# EAGLE design LinearVCA (EAGLE 9.2.0)
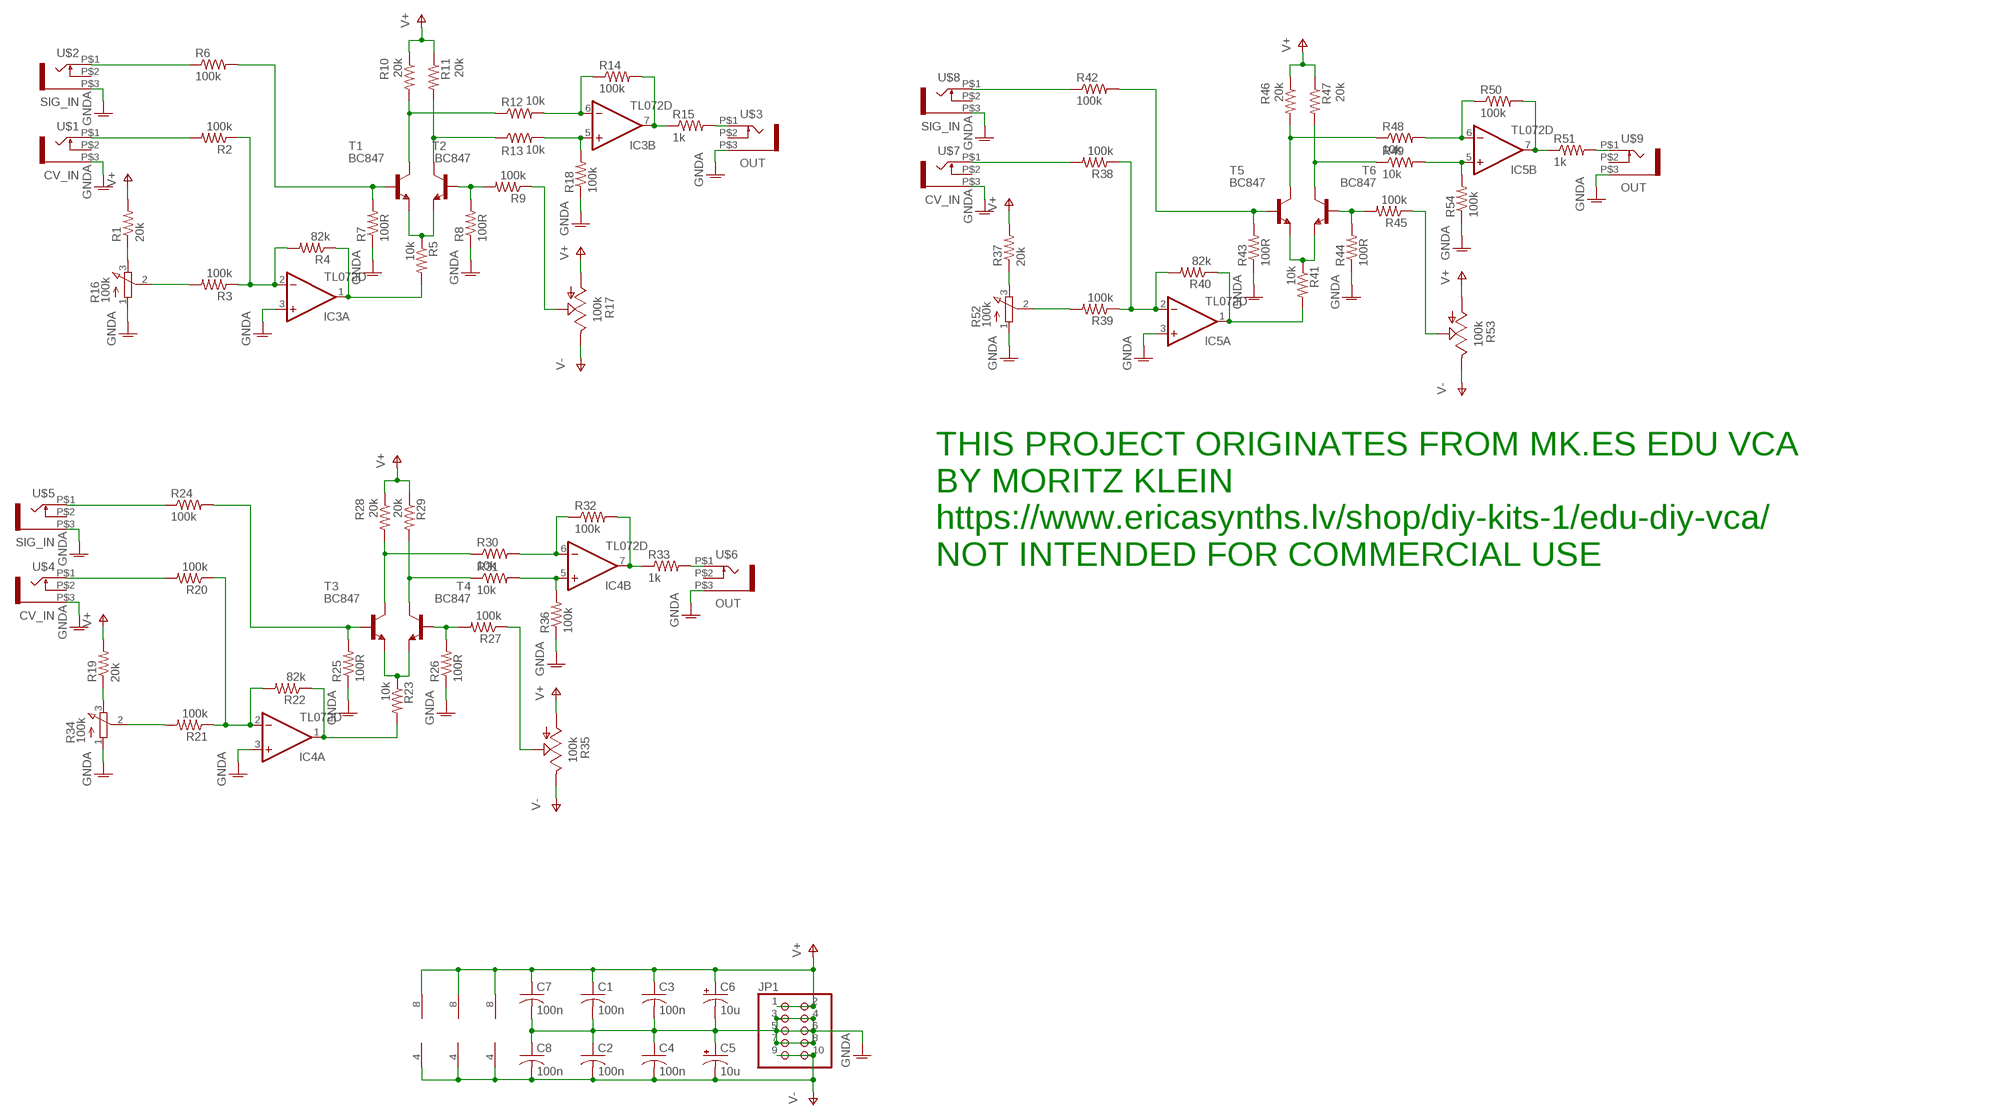
[diagram p0: schematic, sheet 1]

## Parts
C1  100n  C-USC0603K  [C0603K]
C2  100n  C-USC0603K  [C0603K]
C3  100n  C-USC0603K  [C0603K]
C4  100n  C-USC0603K  [C0603K]
C5  10u  CPOL-USE2-5  [E2-5]
C6  10u  CPOL-USE2-5  [E2-5]
C7  100n  C-USC0603K  [C0603K]
C8  100n  C-USC0603K  [C0603K]
IC3  TL072D  [SO08]
IC4  TL072D  [SO08]
IC5  TL072D  [SO08]
JP1  PINHD-2X5  [2X05]
R1  20k  R-US_R0603  [R0603]
R2  100k  R-US_R0603  [R0603]
R3  100k  R-US_R0603  [R0603]
R4  82k  R-US_R0603  [R0603]
R5  10k  R-US_R0603  [R0603]
R6  100k  R-US_R0603  [R0603]
R7  100R  R-US_R0603  [R0603]
R8  100R  R-US_R0603  [R0603]
R9  100k  R-US_R0603  [R0603]
R10  20k  R-US_R0603  [R0603]
R11  20k  R-US_R0603  [R0603]
R12  10k  R-US_R0603  [R0603]
R13  10k  R-US_R0603  [R0603]
R14  100k  R-US_R0603  [R0603]
R15  1k  R-US_R0603  [R0603]
R16  100k  EVUF3K  [EVUFXK]
R17  100k  TRIM_US-RJ9W  [RJ9W]
R18  100k  R-US_R0603  [R0603]
R19  20k  R-US_R0603  [R0603]
R20  100k  R-US_R0603  [R0603]
R21  100k  R-US_R0603  [R0603]
R22  82k  R-US_R0603  [R0603]
R23  10k  R-US_R0603  [R0603]
R24  100k  R-US_R0603  [R0603]
R25  100R  R-US_R0603  [R0603]
R26  100R  R-US_R0603  [R0603]
R27  100k  R-US_R0603  [R0603]
R28  20k  R-US_R0603  [R0603]
R29  20k  R-US_R0603  [R0603]
R30  10k  R-US_R0603  [R0603]
R31  10k  R-US_R0603  [R0603]
R32  100k  R-US_R0603  [R0603]
R33  1k  R-US_R0603  [R0603]
R34  100k  EVUF3K  [EVUFXK]
R35  100k  TRIM_US-RJ9W  [RJ9W]
R36  100k  R-US_R0603  [R0603]
R37  20k  R-US_R0603  [R0603]
R38  100k  R-US_R0603  [R0603]
R39  100k  R-US_R0603  [R0603]
R40  82k  R-US_R0603  [R0603]
R41  10k  R-US_R0603  [R0603]
R42  100k  R-US_R0603  [R0603]
R43  100R  R-US_R0603  [R0603]
R44  100R  R-US_R0603  [R0603]
R45  100k  R-US_R0603  [R0603]
R46  20k  R-US_R0603  [R0603]
R47  20k  R-US_R0603  [R0603]
R48  10k  R-US_R0603  [R0603]
R49  10k  R-US_R0603  [R0603]
R50  100k  R-US_R0603  [R0603]
R51  1k  R-US_R0603  [R0603]
R52  100k  EVUF3K  [EVUFXK]
R53  100k  TRIM_US-RJ9W  [RJ9W]
R54  100k  R-US_R0603  [R0603]
T1  BC847  [SOT23]
T2  BC847  [SOT23]
T3  BC847  [SOT23]
T4  BC847  [SOT23]
T5  BC847  [SOT23]
T6  BC847  [SOT23]
U$1  CV_IN  WQP-PJ301M-12_JACK  [WQP-PJ301M-12_JACK]
U$2  SIG_IN  WQP-PJ301M-12_JACK  [WQP-PJ301M-12_JACK]
U$3  OUT  WQP-PJ301M-12_JACK  [WQP-PJ301M-12_JACK]
U$4  CV_IN  WQP-PJ301M-12_JACK  [WQP-PJ301M-12_JACK]
U$5  SIG_IN  WQP-PJ301M-12_JACK  [WQP-PJ301M-12_JACK]
U$6  OUT  WQP-PJ301M-12_JACK  [WQP-PJ301M-12_JACK]
U$7  CV_IN  WQP-PJ301M-12_JACK  [WQP-PJ301M-12_JACK]
U$8  SIG_IN  WQP-PJ301M-12_JACK  [WQP-PJ301M-12_JACK]
U$9  OUT  WQP-PJ301M-12_JACK  [WQP-PJ301M-12_JACK]

## Nets
GNDA: C1.2 C2.1 C3.2 C4.1 C5.+ C6.- C7.2 C8.1 IC3.3(A:+IN) IC4.3(A:+IN) IC5.3(A:+IN) JP1.3 JP1.4 JP1.5 JP1.6 JP1.7 JP1.8 R7.1 R8.1 R16.1(A) R18.1 R25.1 R26.1 R34.1(A) R36.1 R43.1 R44.1 R52.1(A) R54.1 U$1.P$3 U$2.P$3 U$3.P$3 U$4.P$3 U$5.P$3 U$6.P$3 U$7.P$3 U$8.P$3 U$9.P$3
N$1: IC3.2(A:-IN) R2.1 R3.1 R4.2
N$2: R1.1 R16.3(E)
N$3: R3.2 R16.2(S)
N$4: R2.2 U$1.P$1
N$5: IC3.1(A:OUT) R4.1 R5.2
N$6: R5.1 T1.2(E) T2.2(E)
N$8: R6.2 R7.2 T1.1(B)
N$9: R6.1 U$2.P$1
N$10: R8.2 R9.2 T2.1(B)
N$11: R9.1 R17.S
N$12: R10.2 R12.1 T1.3(C)
N$13: R11.2 R13.1 T2.3(C)
N$14: IC3.6(B:-IN) R12.2 R14.1
N$15: IC3.5(B:+IN) R13.2 R18.2
N$16: R15.2 U$3.P$1
N$17: IC3.7(B:OUT) R14.2 R15.1
N$18: IC4.2(A:-IN) R20.1 R21.1 R22.2
N$19: R19.1 R34.3(E)
N$20: R21.2 R34.2(S)
N$21: IC4.1(A:OUT) R22.1 R23.2
N$22: R23.1 T3.2(E) T4.2(E)
N$23: R20.2 U$4.P$1
N$25: R24.2 R25.2 T3.1(B)
N$26: R24.1 U$5.P$1
N$27: R26.2 R27.2 T4.1(B)
N$28: R27.1 R35.S
N$29: R28.2 R30.1 T3.3(C)
N$30: R29.2 R31.1 T4.3(C)
N$31: IC4.6(B:-IN) R30.2 R32.1
N$32: IC4.5(B:+IN) R31.2 R36.2
N$33: IC4.7(B:OUT) R32.2 R33.1
N$34: R33.2 U$6.P$1
N$35: IC5.2(A:-IN) R38.1 R39.1 R40.2
N$36: R37.1 R52.3(E)
N$37: R39.2 R52.2(S)
N$38: IC5.1(A:OUT) R40.1 R41.2
N$39: R41.1 T5.2(E) T6.2(E)
N$40: R38.2 U$7.P$1
N$42: R42.2 R43.2 T5.1(B)
N$43: R42.1 U$8.P$1
N$44: R44.2 R45.2 T6.1(B)
N$45: R45.1 R53.S
N$46: R46.2 R48.1 T5.3(C)
N$47: R47.2 R49.1 T6.3(C)
N$48: IC5.6(B:-IN) R48.2 R50.1
N$49: IC5.5(B:+IN) R49.2 R54.2
N$50: IC5.7(B:OUT) R50.2 R51.1
N$51: R51.2 U$9.P$1
V+: C1.1 C3.1 C6.+ C7.1 IC3.8(P:V+) IC4.8(P:V+) IC5.8(P:V+) JP1.1 JP1.2 R1.2 R10.1 R11.1 R17.A R19.2 R28.1 R29.1 R35.A R37.2 R46.1 R47.1 R53.A
V-: C2.2 C4.2 C5.- C8.2 IC3.4(P:V-) IC4.4(P:V-) IC5.4(P:V-) JP1.9 JP1.10 R17.E R35.E R53.E
Unconnected: U$1.P$2 U$2.P$2 U$3.P$2 U$4.P$2 U$5.P$2 U$6.P$2 U$7.P$2 U$8.P$2 U$9.P$2

## Notes on the sheet
- THIS PROJECT ORIGINATES FROM MK.ES EDU VCA
  BY MORITZ KLEIN
  https://www.ericasynths.lv/shop/diy-kits-1/edu-diy-vca/
  NOT INTENDED FOR COMMERCIAL USE

## Library data of the parts
C1-C4 C7 C8 = rcl:C-US: CAPACITOR, American symbol; SPICEPREFIX: C
C5 C6 = rcl:CPOL-US: POLARIZED CAPACITOR, American symbol; SPICEPREFIX: C
IC3-IC5 = linear:TL072: OP AMP
JP1 = pinhead:PINHD-2X5: PIN HEADER
R1-R15 R18-R33 R36-R51 R54 = rcl:R-US_: RESISTOR, American symbol; SPICEPREFIX: R
R16 R34 R52 = pot:EVU: 9 mm Square Rotary Potentiometers Source: Panasonic
R17 R35 R53 = pot:TRIM_US-: POTENTIOMETER
T1-T6 = transistor:BC847: NPN TRANSISTOR
U$1-U$9 = thonkiconn:WQP-PJ301M-12_JACK

## Board
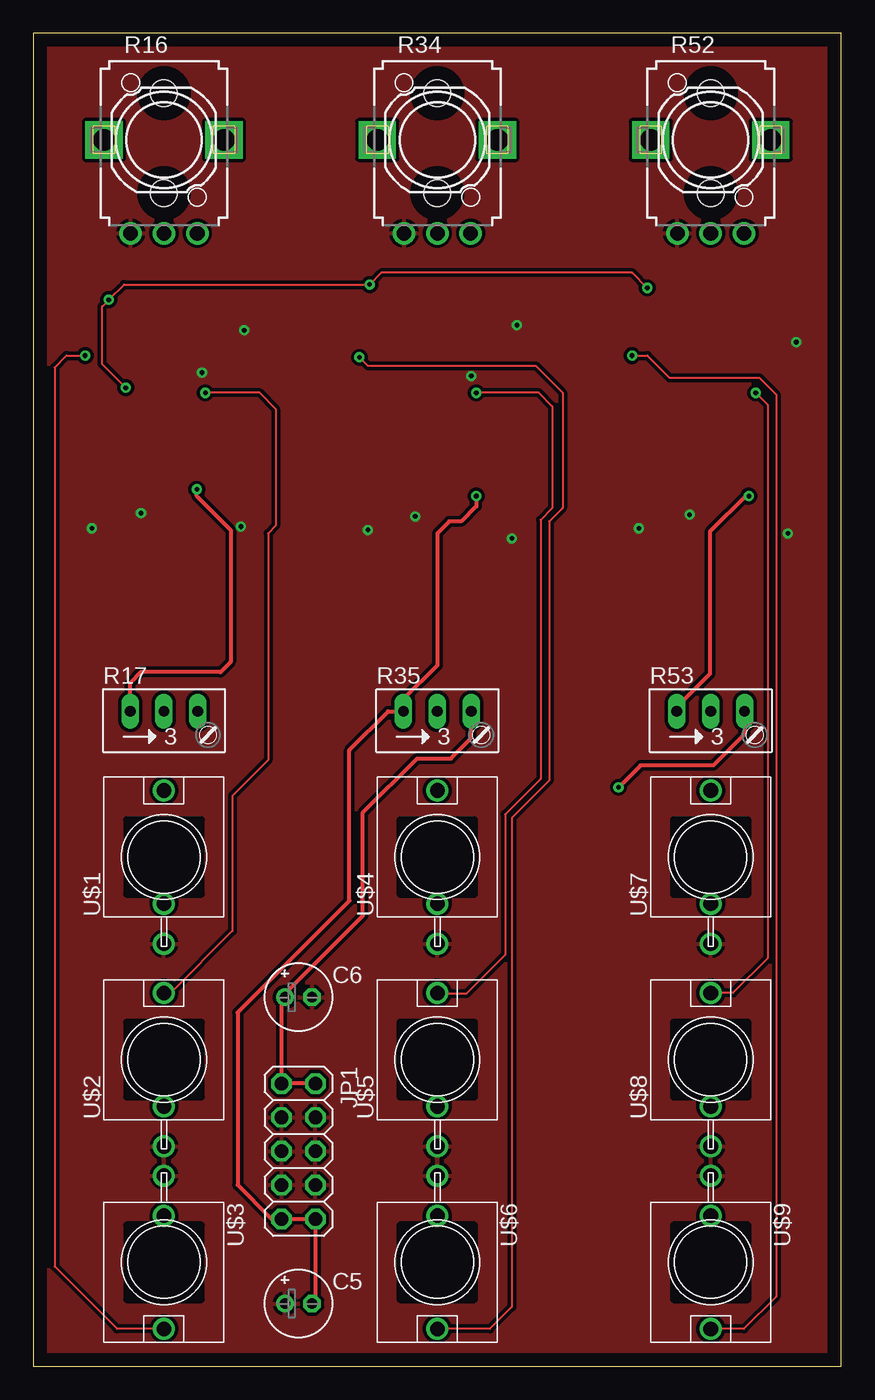
[diagram p1: board, top side]
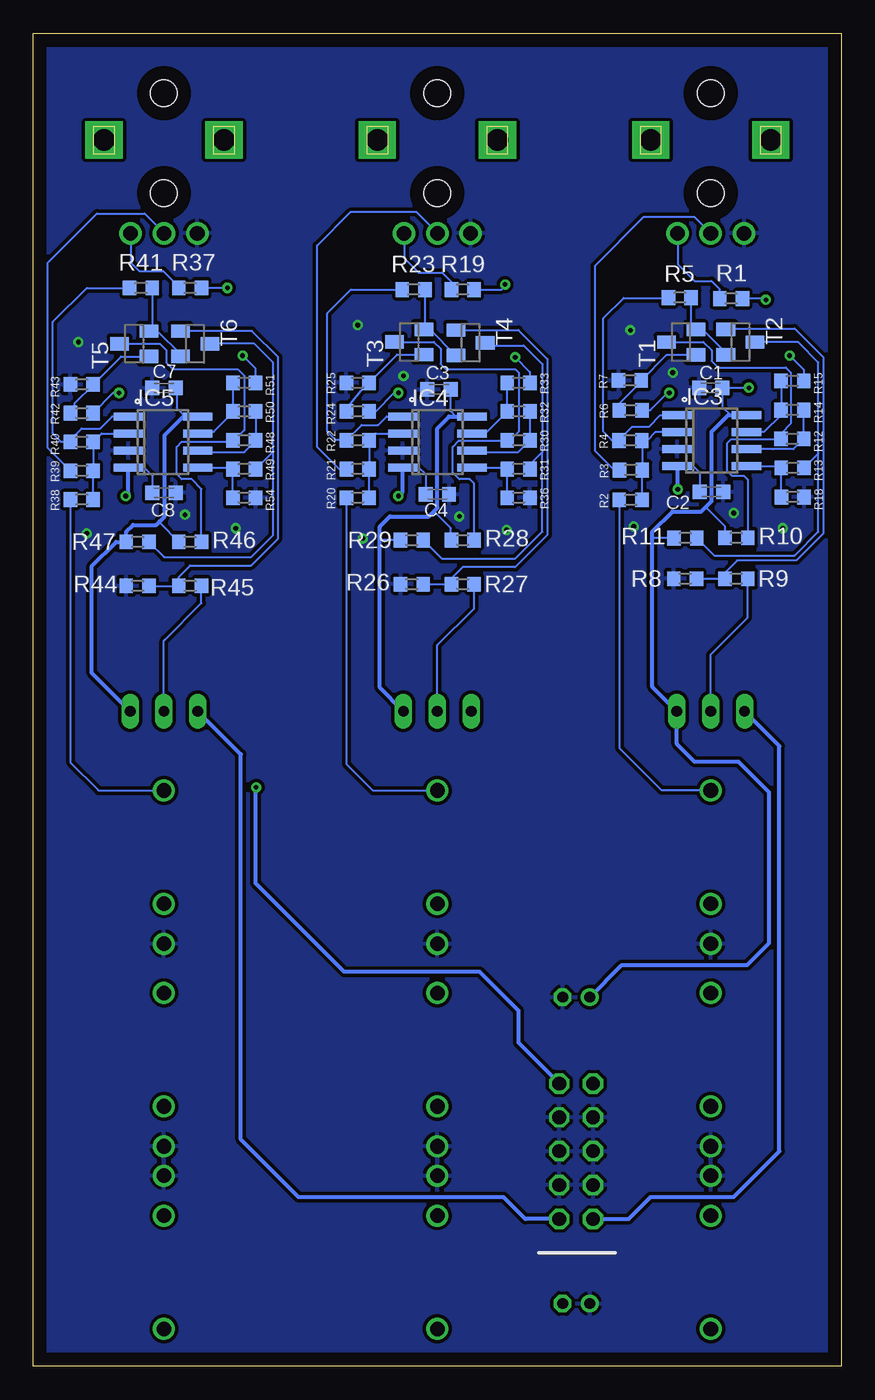
[diagram p2: board, bottom side, seen from below]

Size 60.6 x 100 mm. Coordinates in mm from the lower left corner, seen from the top.
Outline: 0,0 60.6,0 60.6,100 0,100 0,0
Copper layers (1*16): Top 0.035mm / dielectric 1.5mm / Bottom 0.035mm
Design rules "default": minimum track width 6mil, minimum drill 0.35mm, track to track 6mil, track to pad 6mil, pad to pad 6mil, via to via 6mil, smd to smd 6mil, copper to edge 40mil, drill to drill 6mil, minimum pad ring 10mil, minimum via ring 8mil, stop-mask expansion 4mil, vias tented up to drill 0mil, thermal gap 10mil

### Footprints (pad centres in the part's own frame; a part is rotated, then mirrored left to right if it is on the bottom)
C0603K = smd 1.05 x 1.08: 1 -0.875,0; 2 0.875,0
E2-5 = drill 0.813 pad 1.27: + -1.016,0 | drill 0.813 pad 1.27 octagon: - 1.016,0
SO08 = smd 0.6 x 2.2: 1 -1.905,-2.6; 2 -0.635,-2.6; 3 0.635,-2.6; 4 1.905,-2.6; 5 1.905,2.6; 6 0.635,2.6; 7 -0.635,2.6; 8 -1.905,2.6
2X05 = drill 1.016 octagon: 1 -5.08,-1.27; 2 -5.08,1.27; 3 -2.54,-1.27; 4 -2.54,1.27; 5 0,-1.27; 6 0,1.27; 7 2.54,-1.27; 8 2.54,1.27; 9 5.08,-1.27; 10 5.08,1.27
R0603 = smd 1 x 1.1: 1 -0.85,0; 2 0.85,0
EVUFXK = drill 1.1 pad 1.676: 1 -2.5,-7; 2 0,-7; 3 2.5,-7 | drill 1.6 pad 2.8 square: M1 4.5,0; M2 -4.5,0 | hole 2: 0,3.5; 0,-4
RJ9W = drill 0.813 long: A 2.54,0.635; E -2.54,0.635; S 0,0.635
SOT23 = smd 1 x 1.4: 1 -0.95,-1.1; 2 0.95,-1.1; 3 0,1.1
WQP-PJ301M-12_JACK = drill 1.1: P$1 0,5; P$2 0,-3.5; P$3 0,-6.5

### Placement (x,y rotation side)
C1  9.79,73.41 180 bottom
C2  9.74,65.59 180 bottom
C3  30.17,73.28 180 bottom
C4  30.3,65.41 180 bottom
C5  19.89,4.7 0 top
C6  19.89,27.69 0 top
C7  50.79,73.39 180 bottom
C8  50.79,65.53 180 bottom
IC3  9.72,69.43 270 bottom
IC4  30.3,69.34 270 bottom
IC5  50.87,69.34 270 bottom
JP1  19.89,16.13 270 top
R1  8.27,80.1 0 bottom
R2  15.81,64.99 180 bottom
R3  15.79,67.23 180 bottom
R4  15.81,69.45 0 bottom
R5  12.11,80.17 180 bottom
R6  15.81,71.72 180 bottom
R7  15.86,73.96 0 bottom
R8  11.72,59.08 0 bottom
R9  7.87,59.08 180 bottom
R10  7.87,62.15 0 bottom
R11  11.7,62.14 0 bottom
R12  3.67,69.57 0 bottom
R13  3.66,67.39 180 bottom
R14  3.67,71.73 180 bottom
R15  3.67,73.91 0 bottom
R16  9.8,92 0 top
R17  9.8,48.5 0 top
R18  3.64,65.21 180 bottom
R19  28.39,80.77 0 bottom
R20  36.27,65.15 180 bottom
R21  36.27,67.31 180 bottom
R22  36.27,69.47 0 bottom
R23  32.08,80.77 180 bottom
R24  36.27,71.63 180 bottom
R25  36.27,73.79 0 bottom
R26  32.2,58.67 0 bottom
R27  28.39,58.67 180 bottom
R28  28.39,61.98 0 bottom
R29  32.2,61.98 0 bottom
R30  24.2,69.47 0 bottom
R31  24.2,67.31 180 bottom
R32  24.2,71.63 180 bottom
R33  24.2,73.79 0 bottom
R34  30.3,92 0 top
R35  30.3,48.5 0 top
R36  24.2,65.15 180 bottom
R37  48.84,80.9 0 bottom
R38  56.97,65.02 180 bottom
R39  56.97,67.18 180 bottom
R40  56.97,69.34 0 bottom
R41  52.53,80.9 180 bottom
R42  56.97,71.5 180 bottom
R43  56.97,73.66 0 bottom
R44  52.78,58.55 0 bottom
R45  48.84,58.55 180 bottom
R46  48.84,61.85 0 bottom
R47  52.78,61.85 0 bottom
R48  44.78,69.47 0 bottom
R49  44.78,67.31 180 bottom
R50  44.78,71.63 180 bottom
R51  44.78,73.79 0 bottom
R52  50.8,92 0 top
R53  50.8,48.5 0 top
R54  44.78,65.15 180 bottom
T1  12.01,76.83 90 bottom
T2  7.57,76.83 270 bottom
T3  32.41,76.85 90 bottom
T4  27.81,76.78 270 bottom
T5  53.03,76.71 90 bottom
T6  48.46,76.71 270 bottom
U$1  9.8,38.2 0 top
U$2  9.8,23 0 top
U$3  9.8,7.8 180 top
U$4  30.3,38.2 0 top
U$5  30.3,23 0 top
U$6  30.3,7.8 180 top
U$7  50.8,38.2 0 top
U$8  50.8,23 0 top
U$9  50.8,7.8 180 top

### Tracks (layer width: path | path; a pad name or v marks a point on that pad's centre or on a via)
GNDA  (via drill 0.35)
  other vias: 4.39,62.87 12.65,74.55 15.82,77.72 25.09,62.74 36.27,78.11 32.84,74.3 56.59,62.48 49.22,63.88 45.41,62.87 35.89,62.1 15.57,62.99 28.65,63.75 8.07,64.01 57.22,76.83
  pour Top (isolate 0.254): 60.53,99.95 0.07,99.95 0.07,0 60.4,0 60.53,-0.13
  pour Bottom (isolate 0.254): 60.53,99.95 -0.05,99.95 -0.05,0 60.53,0
N$1
  Bottom 0.152: IC3.2 12.36,70.1 13.92,70.1 14.57,69.45 R4.2 14.94,69.42 R3.1 14.94,65.01 R2.1
N$2
  Bottom 0.152: R1.1 9.12,80.8 9.73,81.41 11,81.41 12.27,82.68 12.27,84.97 R16.3
N$3
  Bottom 0.152: R3.2 17.02,67.23 18.49,68.71 18.49,82.55 14.81,86.23 11.03,86.23 R16.2
N$4
  Bottom 0.152: U$1.P$1 13.48,43.2 16.66,46.37 R2.2
N$5
  Bottom 0.152: IC3.1 13.57,71.34 14.43,70.48 15.7,70.48 16.66,69.52 R4.1 16.68,69.47 17.22,69.47 17.85,70.1 17.85,78.61 16.33,80.14 13,80.14 R5.2
N$6
  Bottom 0.152: T2.2 8.67,76.05 10.35,77.73 10.86,77.73 T1.2 11.26,78.14 R5.1
N$8
  Bottom 0.152: T1.1 13.08,75.89 R7.2 14.96,73.91 16.66,72.21 R6.2
N$9  (via drill 0.35)
  Top 0.152: v12.9,73.03 16.96,73.03 18.17,71.82 18.17,63.06 17.6,62.48 17.6,45.47 14.93,42.8 14.93,32.64 10.29,28 U$2.P$1
  Bottom 0.152: R6.1 14.32,71.72 13.02,73.03 v12.9,73.03
N$10
  Bottom 0.152: R8.2 R9.2 8.72,59.55 7.82,60.45 3.38,60.45 1.34,62.48 1.34,75.69 3.5,77.85 8.6,77.85 T2.1
N$11
  Bottom 0.152: R17.S 9.8,53.39 7.02,56.17 R9.1
N$12
  Bottom 0.152: T1.3 10.34,76.83 9.73,76.22 9.73,75.42 9.23,74.93 4.17,74.93 3.76,74.52 3.76,70.74 4.52,69.98 R12.1 4.55,69.54 8.26,69.54 8.58,69.22 8.58,67.18 8.2,66.8 7.31,66.8 7.02,66.51 R10.2
N$13
  Bottom 0.152: R13.1 1.73,68.47 | 1.73,68.47 1.73,75.31 3.25,76.83 T2.3 | R11.2 9.55,60.83 3.5,60.83 1.73,62.61 1.73,68.47
N$14
  Bottom 0.152: R14.1 R12.2 3.6,68.79 5.11,68.79 5.12,68.8 IC3.6
N$15
  Bottom 0.152: R18.2 4.51,65.22 R13.2 4.64,67.53 IC3.5
N$16  (via drill 0.35)
  Top 0.152: U$3.P$1 6.29,2.8 1.6,7.49 1.6,74.93 2.49,75.82 v3.88,75.82
  Bottom 0.152: v3.88,75.82 2.82,74.76 R15.2
N$17
  Bottom 0.152: IC3.7 7.09,70.1 5.79,70.1 4.52,71.38 R14.2 R15.1
N$18
  Bottom 0.152: R20.1 R21.1 R22.2 34.91,69.98 IC4.2
N$19
  Bottom 0.152: R34.3 32.8,83.14 31.7,82.04 29.92,82.04 29.25,81.37 R19.1
N$20
  Bottom 0.152: R21.2 37.67,67.31 39.32,68.96 39.32,84.07 36.78,86.61 31.87,86.61 30.3,85.04 R34.2
N$21
  Bottom 0.152: IC4.1 34.11,71.25 34.75,70.61 35.98,70.61 R22.1 37.92,69.47 38.55,70.1 38.55,78.99 36.78,80.77 R23.2
N$22
  Bottom 0.152: R23.1 31.23,77.88 T3.2 30.88,77.8 T4.2
N$23
  Bottom 0.152: R20.2 37.12,45.17 35.13,43.18 30.32,43.18 U$4.P$1
N$25
  Bottom 0.152: R24.2 37.12,71.79 36.02,73.19 R25.2 33.31,75.9 T3.1
N$26  (via drill 0.35)
  Top 0.152: v33.22,73.03 37.92,73.03 38.94,72.01 38.94,64.39 38.05,63.5 38.05,44.07 35.38,41.4 35.38,30.86 32.46,27.94 30.36,27.94 U$5.P$1
  Bottom 0.152: R24.1 34.91,71.63 33.51,73.03 v33.22,73.03
N$27
  Bottom 0.152: T4.1 24.21,77.73 22.05,75.56 22.05,62.36 24.46,59.94 28.39,59.94 29.25,59.09 R27.2 R26.2
N$28
  Bottom 0.152: R35.S 30.3,54.1 27.55,56.86 R27.1
N$29
  Bottom 0.152: T3.3 30.57,76.85 30.05,76.33 30.05,75.18 29.66,74.8 24.46,74.8 24.2,74.55 24.2,70.1 24.84,69.47 R30.1 25.08,69.45 28.68,69.45 29.16,68.97 29.16,67.06 28.65,66.55 27.89,66.55 27.55,66.21 R28.2
N$30
  Bottom 0.152: T4.3 26.51,76.58 23.82,76.58 22.43,75.18 22.43,68.71 22.43,68.58 | 22.43,68.58 23.35,67.65 R31.1 | R29.2 29.96,60.58 24.46,60.58 22.43,62.61 22.43,68.58
N$31
  Bottom 0.152: R32.1 R30.2 24.24,68.58 26.74,68.58 26.87,68.71 IC4.6
N$32
  Bottom 0.152: IC4.5 25.18,67.44 R31.2 R36.2
N$33
  Bottom 0.152: IC4.7 26.71,69.98 R32.2 R33.1
N$34  (via drill 0.35)
  Top 0.152: U$6.P$1 34.24,2.79 35.89,4.45 35.89,41.15 38.68,43.94 38.68,63.37 39.7,64.39 39.7,73.03 37.67,75.06 25.09,75.06 v24.46,75.69
  Bottom 0.152: v24.46,75.69 23.35,74.59 R33.2
N$35
  Bottom 0.152: R38.1 R39.1 R40.2 55.48,69.98 IC5.2
N$36
  Bottom 0.152: R52.3 53.29,84.99 53.29,82.8 52.65,82.17 50.87,82.17 49.69,80.99 R37.1
N$37
  Bottom 0.152: R39.2 59.51,68.87 59.51,82.81 55.83,86.49 52.25,86.49 50.8,85.04 R52.2
N$38
  Bottom 0.152: IC5.1 54.68,71.25 55.57,70.36 56.97,70.36 57.82,69.51 R40.1 58.49,69.34 59.13,69.98 59.13,78.36 56.59,80.9 R41.2
N$39
  Bottom 0.152: R41.1 51.67,77.92 T5.2 51.3,77.66 49.56,75.92 T6.2
N$40
  Bottom 0.152: R38.2 57.82,45.3 55.7,43.18 50.82,43.18 U$7.P$1
N$42
  Bottom 0.152: R42.2 57.48,71.84 57.48,72.26 56.12,73.62 R43.2 54.02,75.76 T5.1
N$43  (via drill 0.35)
  Top 0.152: v54.18,73.03 55.06,72.14 55.06,30.61 52.46,28 U$8.P$1
  Bottom 0.152: R42.1 54.6,73.03 v54.18,73.03
N$44
  Bottom 0.152: R44.2 R45.2 49.69,59.22 48.84,60.07 44.27,60.07 42.24,62.1 42.24,75.69 44.21,77.66 T6.1
N$45
  Bottom 0.152: R53.S 50.8,54.43 50.75,54.48 47.99,57.24 R45.1
N$46
  Bottom 0.152: T5.3 51.11,76.71 50.62,76.22 50.62,75.29 50.13,74.8 45.27,74.8 44.78,74.31 44.78,70.23 45.54,69.47 R48.1 45.73,69.36 49.46,69.36 49.86,68.96 49.86,66.93 49.48,66.55 48.72,66.55 47.99,65.83 R46.2
N$47
  Bottom 0.152: R47.2 50.79,60.71 44.27,60.71 42.62,62.36 42.62,68.62 | T6.3 44.02,76.71 42.62,75.31 42.62,68.83 42.62,68.62 | R49.1 42.62,68.62
N$48
  Bottom 0.152: R50.1 R48.2 43.93,69.43 44.78,68.58 48.21,68.58 48.27,68.65 IC5.6
N$49
  Bottom 0.152: IC5.5 45.76,67.44 R49.2 R54.2
N$50
  Bottom 0.152: IC5.7 48.15,70.1 47.06,70.1 45.63,71.54 R50.2 R51.1
N$51  (via drill 0.35)
  Top 0.152: v44.91,75.82 46.05,75.82 47.7,74.17 54.43,74.17 55.7,72.9 55.7,5.21 53.29,2.79 U$9.P$1
  Bottom 0.152: R51.2 43.93,74.84 v44.91,75.82
V+  (via drill 0.35)
  Top 0.152: v6.93,73.41 5.15,75.18 5.15,79.5 v5.66,80.01 6.8,81.15 v25.22,81.15 26.11,82.04 44.91,82.04 v46.05,80.9
  Top 0.305: JP1.2 JP1.1 18.62,27.43 C6.+ 18.87,27.94 24.71,33.78 24.71,41.53 28.78,45.59 31.32,45.59 32.84,47.12 R35.A | R53.A 53.34,47.42 51,45.09 45.54,45.09 v43.89,43.43
  Bottom 0.152: IC3.8 8.29,71.34 8.92,71.96 C1.1 v6.93,73.41 | R11.1 14.14,62.14 14.17,62.1 | R10.1 8.72,63 10.17,64.45 | v5.66,80.01 5.75,80.1 R1.2 | IC4.8 28.9,71.25 29.3,71.64 C3.1 | R19.2 25.47,80.77 25.22,81.03 v25.22,81.15 | R29.1 34.62,61.98 | R28.1 29.28,62.02 29.28,62.87 30.49,64.07 30.62,64.07 | C7.1 49.86,73.33 49.86,71.88 49.22,71.25 48.84,71.25 IC5.8 | R46.1 51.13,63.28 51.13,63.37 | v46.05,80.9 R37.2
  Bottom 0.305: C6.+ 16.46,30.1 7.06,30.1 5.41,31.75 5.41,43.05 7.69,45.34 11,45.34 12.34,46.68 R17.A 14.17,50.97 14.17,62.1 14.17,62.61 12.65,64.14 10.49,64.14 10.17,64.45 9.73,64.9 9.73,70.1 8.49,71.34 IC3.8 | R35.A 34.62,50.91 34.62,61.98 34.62,62.99 33.86,63.75 30.94,63.75 30.62,64.07 30.3,64.39 30.3,70.36 29.41,71.25 IC4.8 | R53.A 56.21,52 56.21,60.03 54.39,61.85 R47.1 53.63,62.61 53.12,63.12 51.38,63.12 51.13,63.37 50.75,63.75 50.75,69.85 49.35,71.25 48.84,71.25 | JP1.2 24.2,24.26 24.2,26.67 27.12,29.59 37.29,29.59 43.95,36.26 43.95,43.37 v43.89,43.43
V-  (via drill 0.35)
  Top 0.305: C5.- 21.16,4.95 JP1.10 JP1.9 17.85,11.05 15.31,13.59 15.31,26.54 23.7,34.92 23.7,46.23 26.6,49.13 R35.E 27.76,50.04 30.3,52.58 30.3,62.48 31.19,63.37 32.08,63.37 33.22,64.52 v33.22,65.28 | R17.E 7.26,51.26 8.07,52.07 14.04,52.07 14.81,52.83 14.81,62.74 12.27,65.28 v12.27,65.79 | v53.67,65.28 53.41,65.28 50.75,62.61 50.75,51.94 48.26,49.46 R53.E
  Bottom 0.152: IC3.4 12.23,67.44 11,67.44 10.62,67.06 C2.2 | IC4.4 31.7,67.44 31.18,66.92 C4.2 | IC5.4 52.27,67.44 51.67,66.83 C8.2
  Bottom 0.305: v12.27,65.79 12.27,67.47 IC3.4 | JP1.9 15.95,11.05 14.3,12.7 8.07,12.7 4.65,16.13 4.65,46.52 R17.E | JP1.10 23.7,11.05 25.35,12.7 40.71,12.7 45.03,17.02 45.03,45.91 R53.E | v53.67,65.28 53.47,65.47 IC5.4 | v33.22,65.28 32.9,65.6 IC4.4